# EAGLE design BORD 1 (EAGLE 9.6.2)
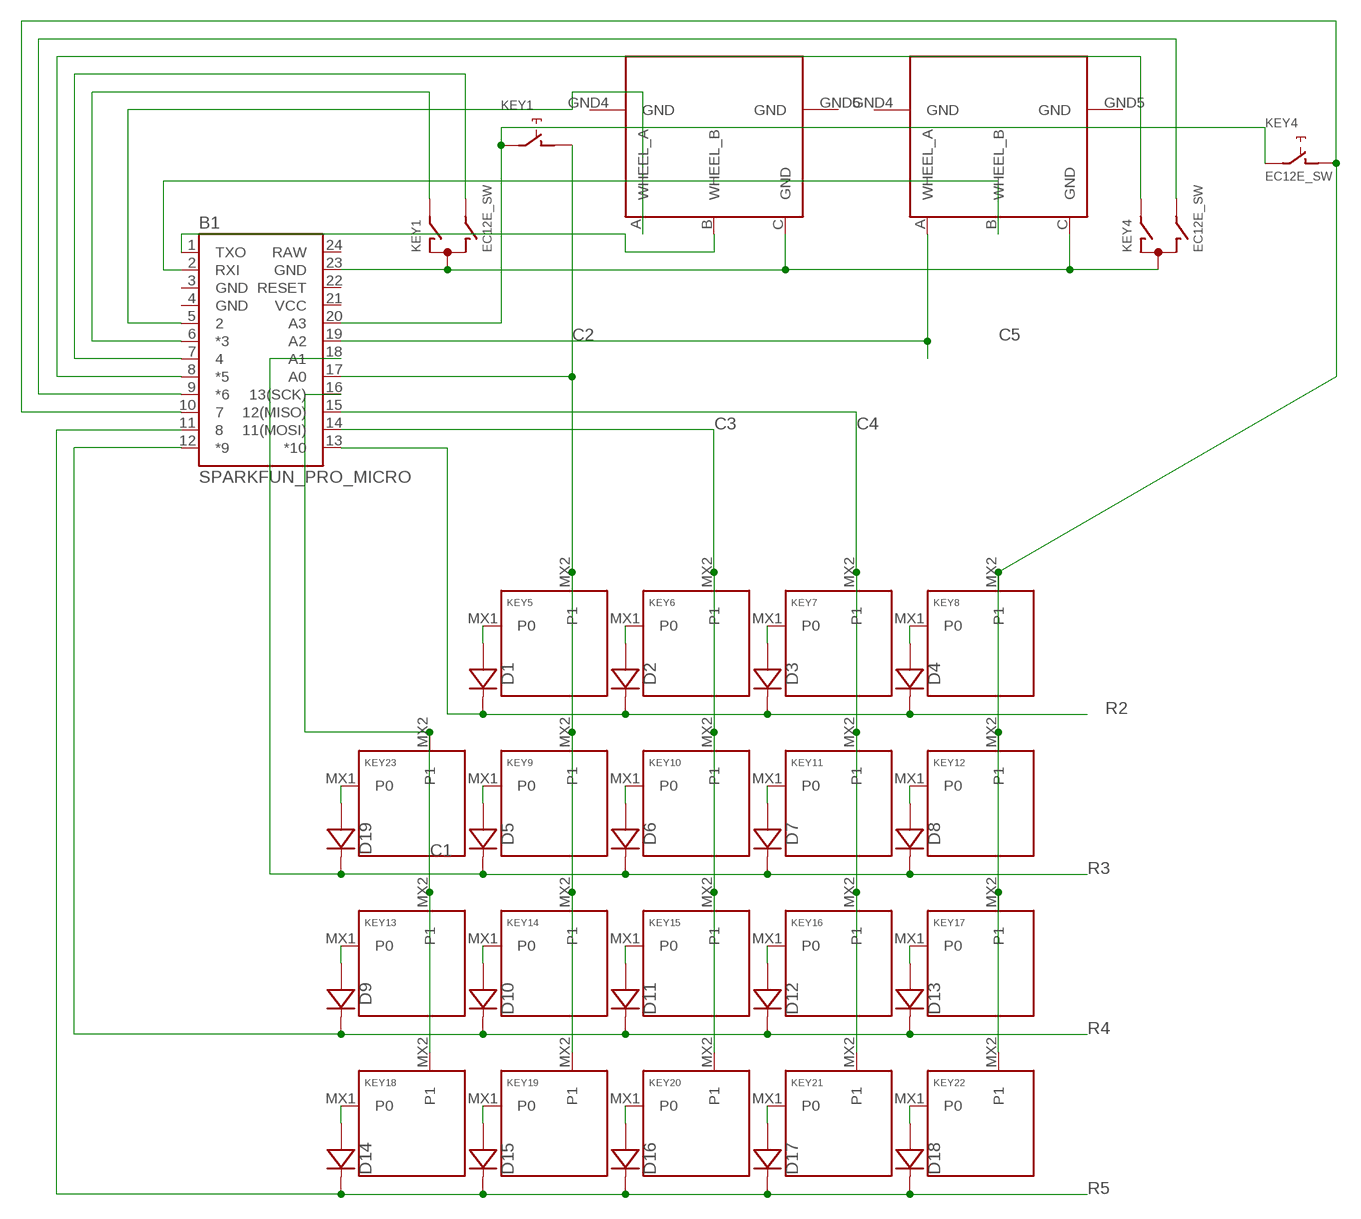
[diagram p0: schematic, sheet 1]

## Parts
B1  SPARKFUN_PRO_MICRO  [SPARKFUN_PRO_MICRO]
D1  DIODE-HAND  [DIODE_HAND]
D2  DIODE-HAND  [DIODE_HAND]
D3  DIODE-HAND  [DIODE_HAND]
D4  DIODE-HAND  [DIODE_HAND]
D5  DIODE-HAND  [DIODE_HAND]
D6  DIODE-HAND  [DIODE_HAND]
D7  DIODE-HAND  [DIODE_HAND]
D8  DIODE-HAND  [DIODE_HAND]
D9  DIODE-HAND  [DIODE_HAND]
D10  DIODE-HAND  [DIODE_HAND]
D11  DIODE-HAND  [DIODE_HAND]
D12  DIODE-HAND  [DIODE_HAND]
D13  DIODE-HAND  [DIODE_HAND]
D14  DIODE-HAND  [DIODE_HAND]
D15  DIODE-HAND  [DIODE_HAND]
D16  DIODE-HAND  [DIODE_HAND]
D17  DIODE-HAND  [DIODE_HAND]
D18  DIODE-HAND  [DIODE_HAND]
D19  DIODE-HAND  [DIODE_HAND]
KEY1  EC12E_SW  [ALPS_EC12E_SW]
KEY2  MOUSE_WHEEL_ENCODER  [MOUSE-PART]
KEY3  MOUSE_WHEEL_ENCODER  [MOUSE-PART]
KEY4  EC12E_SW  [ALPS_EC12E_SW]
KEY5  KEYSWITCH-PLAIN-MX-1U  [MX-1U]
KEY6  KEYSWITCH-PLAIN-MX-1U  [MX-1U]
KEY7  KEYSWITCH-PLAIN-MX-1U  [MX-1U]
KEY8  KEYSWITCH-PLAIN-MX-1U  [MX-1U]
KEY9  KEYSWITCH-PLAIN-MX-1U  [MX-1U]
KEY10  KEYSWITCH-PLAIN-MX-1U  [MX-1U]
KEY11  KEYSWITCH-PLAIN-MX-1U  [MX-1U]
KEY12  KEYSWITCH-PLAIN-MX-1U  [MX-1U]
KEY13  KEYSWITCH-PLAIN-MX-1U  [MX-1U]
KEY14  KEYSWITCH-PLAIN-MX-1U  [MX-1U]
KEY15  KEYSWITCH-PLAIN-MX-1U  [MX-1U]
KEY16  KEYSWITCH-PLAIN-MX-1U  [MX-1U]
KEY17  KEYSWITCH-PLAIN-MX-1U  [MX-1U]
KEY18  KEYSWITCH-PLAIN-MX-1U  [MX-1U]
KEY19  KEYSWITCH-PLAIN-MX-1U  [MX-1U]
KEY20  KEYSWITCH-PLAIN-MX-1U  [MX-1U]
KEY21  KEYSWITCH-PLAIN-MX-1U  [MX-1U]
KEY22  KEYSWITCH-PLAIN-MX-1U  [MX-1U]
KEY23  KEYSWITCH-PLAIN-MX-1U  [MX-1U]

## Nets
C1: B1.16(13(SCK)) KEY13.MX2(P1) KEY18.MX2(P1) KEY23.MX2(P1)
C2: B1.17(A0) KEY1.D KEY5.MX2(P1) KEY9.MX2(P1) KEY14.MX2(P1) KEY19.MX2(P1)
C3: B1.14(11(MOSI)) KEY6.MX2(P1) KEY10.MX2(P1) KEY15.MX2(P1) KEY20.MX2(P1)
C4: B1.15(12(MISO)) KEY7.MX2(P1) KEY11.MX2(P1) KEY16.MX2(P1) KEY21.MX2(P1)
C5: B1.10 KEY4.D KEY8.MX2(P1) KEY12.MX2(P1) KEY17.MX2(P1) KEY22.MX2(P1)
N$1: D1.A1(A) D1.A2(A) D1.A3(A) KEY5.MX1(P0)
N$2: D2.A1(A) D2.A2(A) D2.A3(A) KEY6.MX1(P0)
N$3: D3.A1(A) D3.A2(A) D3.A3(A) KEY7.MX1(P0)
N$4: D4.A1(A) D4.A2(A) D4.A3(A) KEY8.MX1(P0)
N$5: D5.A1(A) D5.A2(A) D5.A3(A) KEY9.MX1(P0)
N$6: D6.A1(A) D6.A2(A) D6.A3(A) KEY10.MX1(P0)
N$7: D7.A1(A) D7.A2(A) D7.A3(A) KEY11.MX1(P0)
N$8: D8.A1(A) D8.A2(A) D8.A3(A) KEY12.MX1(P0)
N$9: D9.A1(A) D9.A2(A) D9.A3(A) KEY13.MX1(P0)
N$10: D10.A1(A) D10.A2(A) D10.A3(A) KEY14.MX1(P0)
N$11: D11.A1(A) D11.A2(A) D11.A3(A) KEY15.MX1(P0)
N$12: D12.A1(A) D12.A2(A) D12.A3(A) KEY16.MX1(P0)
N$13: D13.A1(A) D13.A2(A) D13.A3(A) KEY17.MX1(P0)
N$14: D14.A1(A) D14.A2(A) D14.A3(A) KEY18.MX1(P0)
N$15: D15.A1(A) D15.A2(A) D15.A3(A) KEY19.MX1(P0)
N$16: D16.A1(A) D16.A2(A) D16.A3(A) KEY20.MX1(P0)
N$17: D17.A1(A) D17.A2(A) D17.A3(A) KEY21.MX1(P0)
N$18: D18.A1(A) D18.A2(A) D18.A3(A) KEY22.MX1(P0)
N$19: B1.23(GND) KEY1.C KEY2.C(GND) KEY3.C(GND) KEY4.C
N$20: B1.20(A3) KEY1.E KEY4.E
N$21: B1.6(*3) KEY1.A
N$22: B1.7 KEY1.B
N$24: B1.8(*5) KEY4.A
N$25: B1.19(A2) KEY3.A(WHEEL_A)
N$26: B1.5 KEY2.A(WHEEL_A)
N$27: B1.1(TXO) KEY2.B(WHEEL_B)
N$28: B1.9(*6) KEY4.B
N$29: D19.A1(A) D19.A2(A) D19.A3(A) KEY23.MX1(P0)
N$30: B1.2(RXI) KEY3.B(WHEEL_B)
R2: B1.13(*10) D1.C1(C) D1.C2(C) D1.C3(C) D2.C1(C) D2.C2(C) D2.C3(C) D3.C1(C) D3.C2(C) D3.C3(C) D4.C1(C) D4.C2(C) D4.C3(C)
R3: B1.18(A1) D5.C1(C) D5.C2(C) D5.C3(C) D6.C1(C) D6.C2(C) D6.C3(C) D7.C1(C) D7.C2(C) D7.C3(C) D8.C1(C) D8.C2(C) D8.C3(C) D19.C1(C) D19.C2(C) D19.C3(C)
R4: B1.12(*9) D9.C1(C) D9.C2(C) D9.C3(C) D10.C1(C) D10.C2(C) D10.C3(C) D11.C1(C) D11.C2(C) D11.C3(C) D12.C1(C) D12.C2(C) D12.C3(C) D13.C1(C) D13.C2(C) D13.C3(C)
R5: B1.11 D14.C1(C) D14.C2(C) D14.C3(C) D15.C1(C) D15.C2(C) D15.C3(C) D16.C1(C) D16.C2(C) D16.C3(C) D17.C1(C) D17.C2(C) D17.C3(C) D18.C1(C) D18.C2(C) D18.C3(C)
Unconnected: B1.22(RESET) KEY1.GND1(G) KEY1.GND2(G) KEY2.GND4(GND) KEY2.GND5(GND) KEY3.GND4(GND) KEY3.GND5(GND) KEY4.GND1(G) KEY4.GND2(G)

## Power pins joined to a net without a drawn wire
GND: B1.3(GND) B1.4(GND)
RAW: B1.24(RAW)
VCC: B1.21(VCC)

## Library data of the parts
B1 = SparkFun-Boards:SPARKFUN_PRO_MICRO: SparkFun Pro Micro Atmega32U4 compatible footprint. SparkFun Products: 3.3V/8MHz <https://www.sparkfun.com/products/12587> 5V/16MHz <https://www.sparkfun.com/products/12640>
D1-D19 = Components:DIODE: Standard 1N4148 diode
KEY1 KEY4 = switch-alps:EC12E_SW: ALPS rotary Encoder EC12E series with switch; MPN: EC12E2424407; OC_FARNELL: 1520813; OC_NEWARK: 74M1068
KEY2 KEY3 = Mouse:MOUSE_WHEEL_ENCODER
KEY5-KEY23 = Keyboard:KEYSWITCH-PLAIN

## Net classes
0 default: width 0.305 mm, drill 0.508 mm, clearance 0.254 mm

## Board
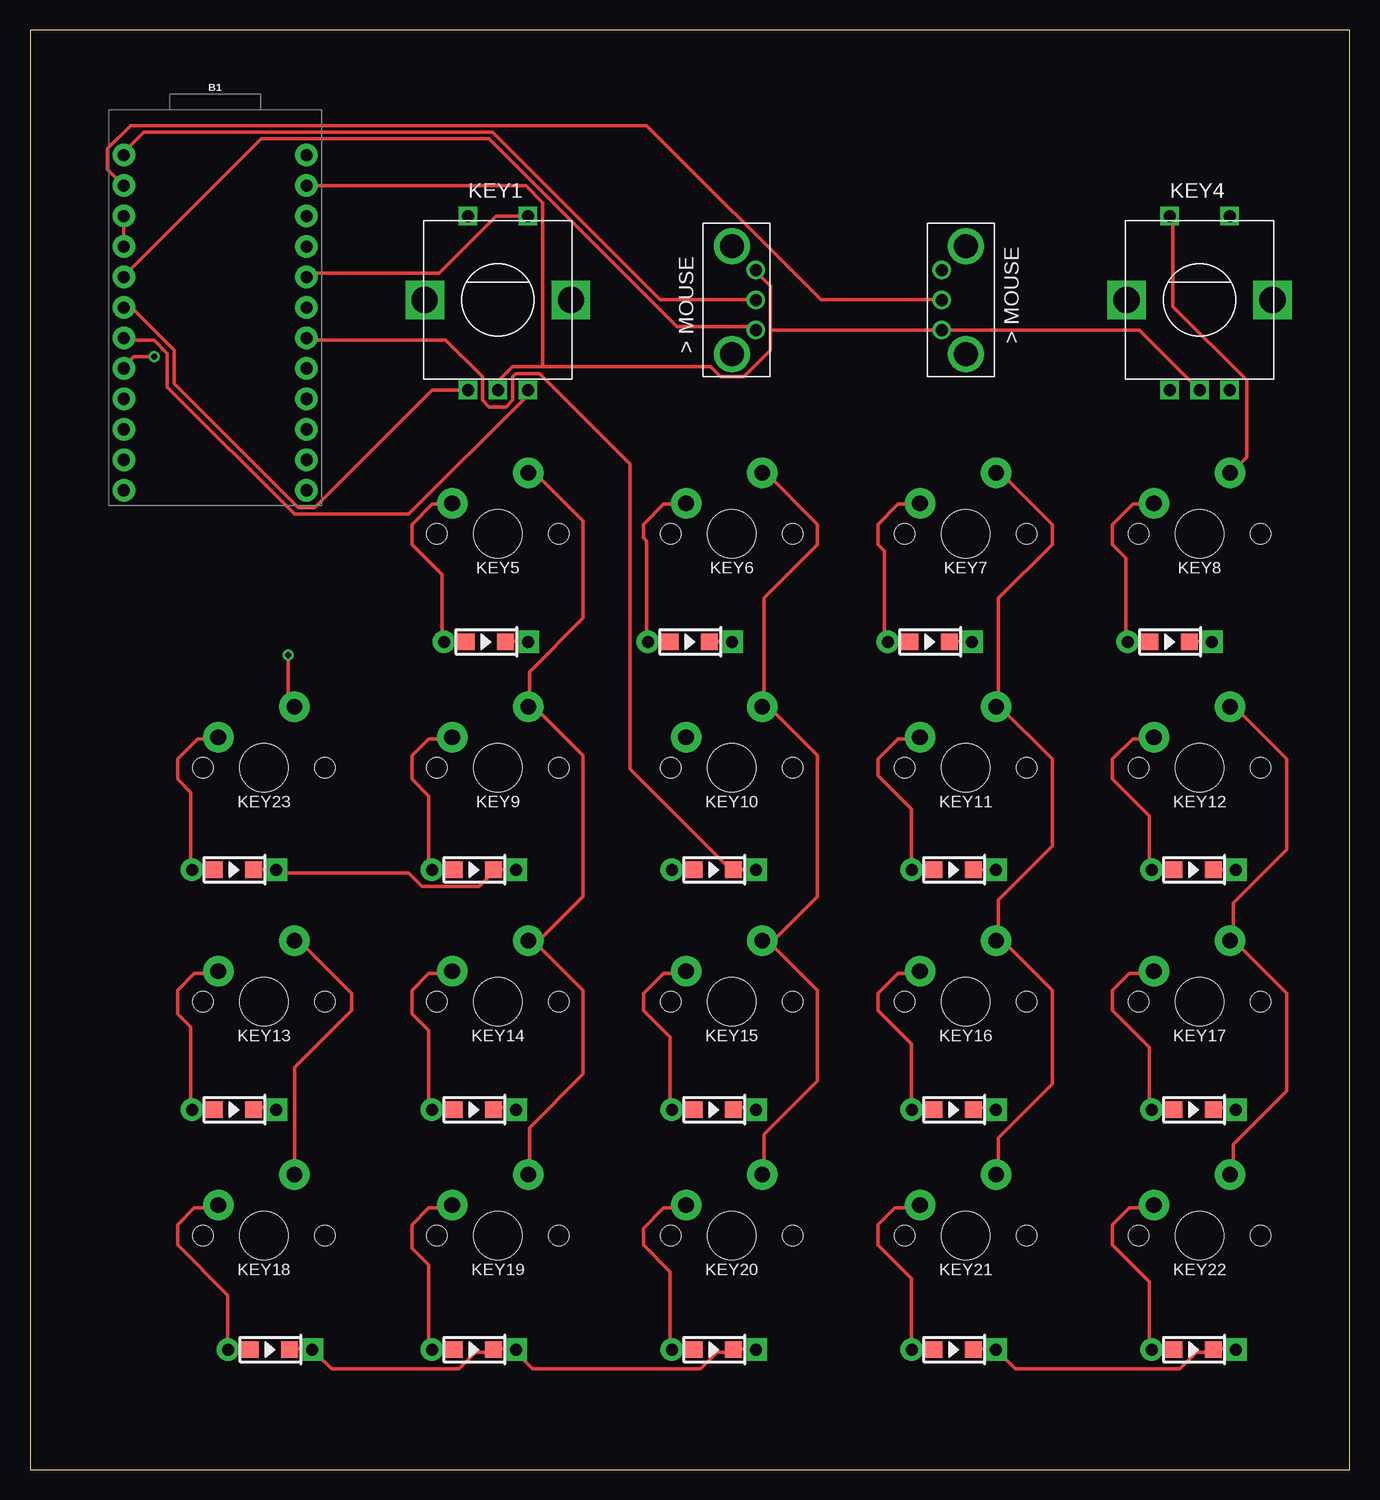
[diagram p1: board, top side]
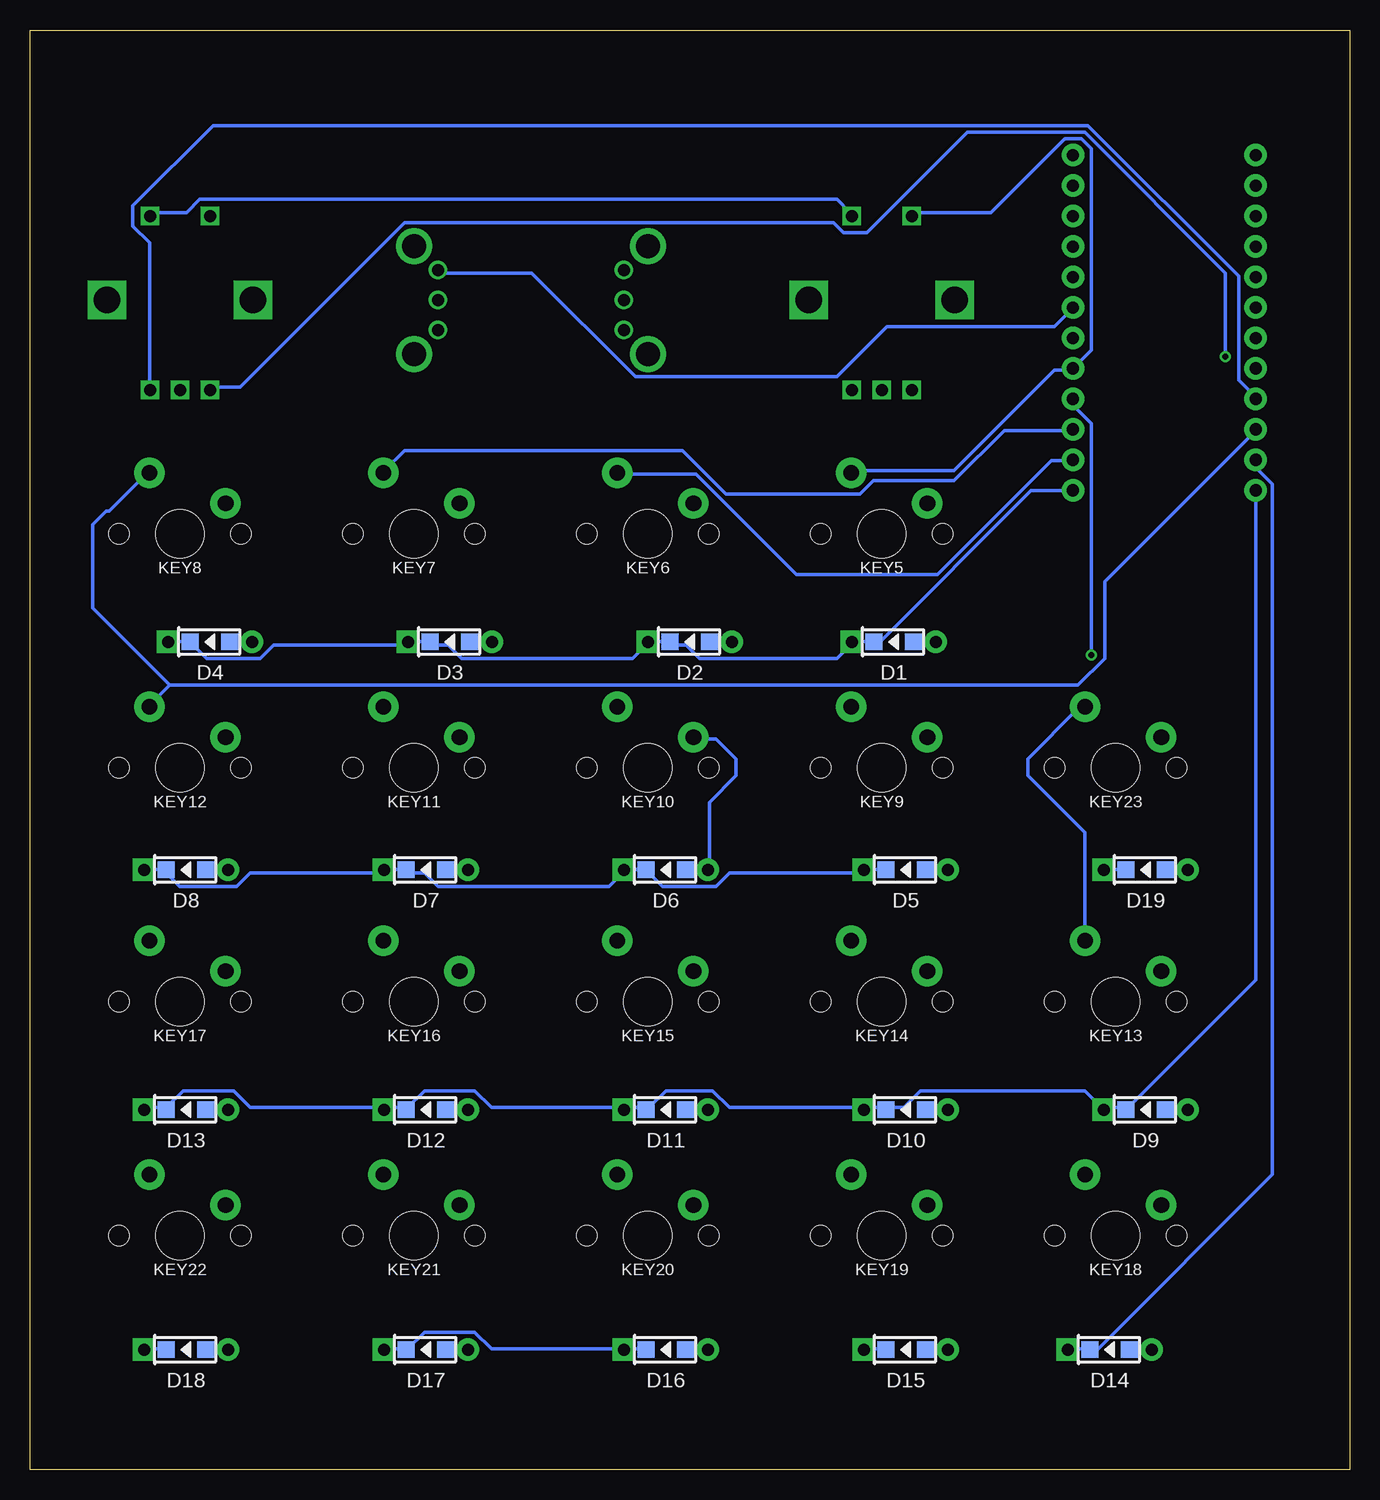
[diagram p2: board, bottom side, seen from below]

Size 110 x 120 mm. Coordinates in mm from the lower left corner, seen from the top.
Outline: 0,0 110,0 110,120 0,120 0,0
Copper layers (1*16): Top 0.035mm / dielectric 1.5mm / Bottom 0.035mm
Design rules "default": minimum track width 6mil, minimum drill 0.35mm, track to track 6mil, track to pad 6mil, pad to pad 6mil, via to via 6mil, smd to smd 6mil, copper to edge 40mil, drill to drill 6mil, minimum pad ring 10mil, minimum via ring 8mil, stop-mask expansion 4mil, vias tented up to drill 0mil, thermal gap 10mil

### Footprints (pad centres in the part's own frame; a part is rotated, then mirrored left to right if it is on the bottom)
SPARKFUN_PRO_MICRO = drill 1.016 pad 1.88: 1 -7.62,12.7; 2 -7.62,10.16; 3 -7.62,7.62; 4 -7.62,5.08; 5 -7.62,2.54; 6 -7.62,0; 7 -7.62,-2.54; 8 -7.62,-5.08; 9 -7.62,-7.62; 10 -7.62,-10.16; 11 -7.62,-12.7; 12 -7.62,-15.24; 13 7.62,-15.24; 14 7.62,-12.7; 15 7.62,-10.16; 16 7.62,-7.62; 17 7.62,-5.08; 18 7.62,-2.54; 19 7.62,0; 20 7.62,2.54; 21 7.62,5.08; 22 7.62,7.62; 23 7.62,10.16; 24 7.62,12.7
DIODE_HAND = smd 1.397 x 1.397: A1 -1.651,0; C1 1.651,0 | drill 1 pad 1.9: A2 -3.5,0 | smd 1.397 x 1.397 bottom: A3 -1.651,0; C3 1.651,0 | drill 1 pad 1.9 square: C2 3.5,0
ALPS_EC12E_SW = drill 1 square: A -2.5,-7.5; B 2.5,-7.5; C 0,-7.5; D -2.5,7; E 2.5,7 | drill 2.2 square: GND1 -6.1,0; GND2 6.1,0
MOUSE-PART = drill 1: A -2.5,-2; B 0,-2; C 2.5,-2 | drill 2: GND4 -4.5,0; GND5 4.5,0
MX-1U = drill 1.3 pad 2.54: MX1 -3.81,2.54; MX2 2.54,5.08 | hole 4: 0,0 | hole 1.7: -5.08,0; 5.08,0

### Placement (x,y rotation side)
B1  15.44,96.86 0 top
D1  38,69 180 bottom
D2  55,69 180 bottom
D3  75,69 180 bottom
D4  95,69 180 bottom
D5  37,50 180 bottom
D6  57,50 180 bottom
D7  77,50 180 bottom
D8  97,50 180 bottom
D9  17,30 180 bottom
D10  37,30 180 bottom
D11  57,30 180 bottom
D12  77,30 180 bottom
D13  97,30 180 bottom
D14  20,10 180 bottom
D15  37,10 180 bottom
D16  57,10 180 bottom
D17  77,10 180 bottom
D18  97,10 180 bottom
D19  17,50 180 bottom
KEY1  39,97.5 0 top
KEY2  58.5,97.5 90 top
KEY3  78,97.5 270 top
KEY4  97.5,97.5 0 top
KEY5  39,78 0 top
KEY6  58.5,78 0 top
KEY7  78,78 0 top
KEY8  97.5,78 0 top
KEY9  39,58.5 0 top
KEY10  58.5,58.5 0 top
KEY11  78,58.5 0 top
KEY12  97.5,58.5 0 top
KEY13  19.5,39 0 top
KEY14  39,39 0 top
KEY15  58.5,39 0 top
KEY16  78,39 0 top
KEY17  97.5,39 0 top
KEY18  19.5,19.5 0 top
KEY19  39,19.5 0 top
KEY20  58.5,19.5 0 top
KEY21  78,19.5 0 top
KEY22  97.5,19.5 0 top
KEY23  19.5,58.5 0 top

### Tracks (layer width: path | path; a pad name or v marks a point on that pad's centre or on a via)
C1  (via drill 0.51)
  Top 0.305: KEY18.MX2 22.07,24.59 22.07,33.53 26.82,38.28 26.82,39.67 22.63,43.87 22.07,43.87 KEY13.MX2 | v21.51,67.89 21.51,63.98 21.79,63.7 KEY23.MX2
  Bottom 0.305: v21.51,67.89 21.51,87.17 22.91,88.57 22.91,89.13 B1.16 | KEY13.MX2 22.07,44.15 22.07,53.09 26.82,57.84 26.82,59.23 22.63,63.42 22.07,63.42 KEY23.MX2
C2
  Top 0.305: 42.19,43.87 46.1,39.95 46.1,32.97 41.63,28.5 41.63,24.59 KEY19.MX2 | 42.19,43.87 41.63,43.87 KEY14.MX2 42.19,43.87 | 42.19,43.87 46.1,47.78 46.1,59.51 42.19,63.42 41.63,63.42 KEY9.MX2 41.63,63.7 41.63,66.5 46.1,70.97 46.1,79.07 42.19,82.98 41.63,82.98 KEY5.MX2
  Bottom 0.305: KEY1.D 36.32,104.78 29.9,104.78 23.75,110.92 22.35,110.92 21.51,110.08 21.51,93.32 22.91,91.92 B1.17 23.19,91.64 24.59,91.64 32.97,83.26 41.35,83.26 KEY5.MX2
C3
  Top 0.305: 61.75,43.87 65.66,39.95 65.66,32.41 61.19,27.94 61.19,24.59 KEY20.MX2 | 61.75,43.87 61.19,43.87 KEY15.MX2 61.75,43.87 | 61.75,43.87 65.66,47.78 65.66,59.51 61.75,63.42 61.19,63.42 KEY10.MX2 61.19,63.7 61.19,72.64 65.66,77.11 65.66,78.79 61.19,83.26 KEY6.MX2
  Bottom 0.305: B1.14 23.19,84.1 24.87,84.1 34.37,74.6 46.1,74.6 54.48,82.98 60.91,82.98 KEY6.MX2
C4
  Top 0.305: KEY21.MX2 80.75,24.59 80.75,27.66 85.22,32.13 85.22,39.95 81.31,43.87 80.75,43.87 KEY16.MX2 80.75,44.15 80.75,47.5 85.22,51.97 85.22,59.23 80.75,63.7 | 80.75,63.7 80.75,72.64 85.22,77.11 85.22,78.79 80.75,83.26 KEY7.MX2 | 80.75,63.7 KEY11.MX2
  Bottom 0.305: B1.15 23.19,86.61 28.78,86.61 32.97,82.42 39.67,82.42 40.79,81.31 51.97,81.31 55.6,84.94 78.79,84.94 80.47,83.26 KEY7.MX2
C5
  Top 0.305: KEY4.D 95.28,104.5 95.28,96.95 101.42,90.81 101.42,84.38 100.31,83.26 KEY8.MX2 | 100.31,44.15 104.78,39.67 104.78,31.57 100.31,27.1 100.31,24.59 KEY22.MX2 | 100.31,44.15 100.31,47.22 104.78,51.69 104.78,59.23 100.31,63.7 KEY12.MX2 | 100.31,44.15 KEY17.MX2
  Bottom 0.305: 98.35,65.38 22.63,65.38 20.4,67.61 20.4,74.04 7.82,86.61 B1.10 | 98.35,65.38 100.03,63.7 KEY12.MX2 | 98.35,65.38 104.78,71.81 104.78,78.79 103.66,79.91 103.38,79.91 100.31,82.98 KEY8.MX2
GND
  Top 0.305: B1.4 7.82,101.98 7.82,104.22 B1.3
N$1
  Top 0.305: D1.A1 36.32,69.01 34.65,69.01 D1.A2 34.37,69.01 34.37,74.6 31.85,77.11 31.85,78.79 33.53,80.47 34.92,80.47 KEY5.MX1
  Bottom 0.305: D1.A1 36.32,69.01 34.65,69.01 D1.A2
N$2
  Top 0.305: D2.A1 53.09,69.01 51.69,69.01 D2.A2 51.41,69.01 51.41,77.39 51.13,77.67 51.13,78.79 52.81,80.47 54.48,80.47 KEY6.MX1
  Bottom 0.305: D2.A1 53.09,69.01 51.69,69.01 D2.A2
N$3
  Top 0.305: D3.A1 73.2,69.01 71.53,69.01 D3.A2 71.25,69.01 71.25,76.56 70.69,77.11 70.69,78.79 72.36,80.47 74.04,80.47 KEY7.MX1
  Bottom 0.305: D3.A1 73.2,69.01 71.53,69.01 D3.A2
N$4
  Top 0.305: D4.A1 93.32,69.01 91.64,69.01 D4.A2 91.36,69.01 91.36,76 90.25,77.11 90.25,78.79 91.92,80.47 93.6,80.47 KEY8.MX1
  Bottom 0.305: D4.A1 93.32,69.01 91.64,69.01 D4.A2
N$5
  Top 0.305: D5.A1 35.2,50.01 33.53,50.01 D5.A2 33.25,50.01 33.25,56.16 31.85,57.56 31.85,59.51 33.25,60.91 34.92,60.91 KEY9.MX1
  Bottom 0.305: D5.A1 35.2,50.01 33.53,50.01 D5.A2
N$6
  Top 0.305: D6.A1 55.32,50.01 53.65,50.01 D6.A2
  Bottom 0.305: D6.A1 55.32,50.01 53.65,50.01 D6.A2 53.37,50.01 53.37,55.6 51.13,57.84 51.13,59.23 52.81,60.91 54.48,60.91 KEY10.MX1
N$7
  Top 0.305: D7.A1 75.16,50.01 73.76,50.01 D7.A2 73.48,50.01 73.48,55.04 70.69,57.84 70.69,59.23 72.36,60.91 74.04,60.91 KEY11.MX1
  Bottom 0.305: D7.A1 75.16,50.01 73.76,50.01 D7.A2
N$8
  Top 0.305: D8.A1 95.28,50.01 93.6,50.01 D8.A2 93.32,50.01 93.32,54.48 90.25,57.56 90.25,59.23 91.92,60.91 93.6,60.91 KEY12.MX1
  Bottom 0.305: D8.A1 95.28,50.01 93.6,50.01 D8.A2
N$9
  Top 0.305: D9.A1 15.09,30.18 13.69,30.18 D9.A2 13.41,30.18 13.41,36.88 12.29,38 12.29,39.95 13.69,41.35 15.65,41.35 KEY13.MX1
  Bottom 0.305: D9.A1 15.09,30.18 13.69,30.18 D9.A2
N$10
  Top 0.305: D10.A1 35.2,30.18 33.53,30.18 D10.A2 33.25,30.18 33.25,36.6 31.85,38 31.85,39.95 33.25,41.35 34.92,41.35 KEY14.MX1
  Bottom 0.305: D10.A1 35.2,30.18 33.53,30.18 D10.A2
N$11
  Top 0.305: D11.A1 55.32,30.18 53.65,30.18 D11.A2 53.37,30.18 53.37,36.04 51.13,38.28 51.13,39.67 52.81,41.35 54.48,41.35 KEY15.MX1
  Bottom 0.305: D11.A1 55.32,30.18 53.65,30.18 D11.A2
N$12
  Top 0.305: D12.A1 75.16,30.18 73.76,30.18 D12.A2 73.48,30.18 73.48,35.48 70.69,38.28 70.69,39.67 72.36,41.35 74.04,41.35 KEY16.MX1
  Bottom 0.305: D12.A1 75.16,30.18 73.76,30.18 D12.A2
N$13
  Top 0.305: D13.A1 95.28,30.18 93.6,30.18 D13.A2 93.32,30.18 93.32,35.2 90.25,38.28 90.25,39.95 91.64,41.35 93.6,41.35 KEY17.MX1
  Bottom 0.305: D13.A1 95.28,30.18 93.6,30.18 D13.A2
N$14
  Top 0.305: D14.A1 18.16,10.06 16.76,10.06 D14.A2 16.48,10.06 16.48,14.53 12.29,18.72 12.29,20.4 13.69,21.79 15.65,21.79 KEY18.MX1
  Bottom 0.305: D14.A1 18.16,10.06 16.76,10.06 D14.A2
N$15
  Top 0.305: D15.A1 35.2,10.06 33.53,10.06 D15.A2 33.25,10.06 33.25,17.04 31.85,18.44 31.85,20.4 33.25,21.79 34.92,21.79 KEY19.MX1
  Bottom 0.305: D15.A1 35.2,10.06 33.53,10.06 D15.A2
N$16
  Top 0.305: D16.A1 55.32,10.06 53.65,10.06 D16.A2 53.37,10.06 53.37,16.48 51.13,18.72 51.13,20.12 52.81,21.79 54.48,21.79 KEY20.MX1
  Bottom 0.305: D16.A1 55.32,10.06 53.65,10.06 D16.A2
N$17
  Top 0.305: D17.A1 75.16,10.06 73.76,10.06 D17.A2 73.48,10.06 73.48,15.93 70.69,18.72 70.69,20.4 72.08,21.79 74.04,21.79 KEY21.MX1
  Bottom 0.305: D17.A1 75.16,10.06 73.76,10.06 D17.A2
N$18
  Top 0.305: D18.A1 95.28,10.06 93.6,10.06 D18.A2 93.32,10.06 93.32,15.65 90.25,18.72 90.25,20.4 91.64,21.79 93.6,21.79 KEY22.MX1
  Bottom 0.305: D18.A1 95.28,10.06 93.6,10.06 D18.A2
N$19
  Top 0.305: 42.75,91.92 56.72,91.92 57.56,91.08 59.51,91.08 61.75,93.32 61.75,95 | 42.75,91.92 40.23,91.92 39.12,90.81 39.12,90.25 KEY1.C | 61.75,95 61.75,98.63 60.63,99.75 KEY2.C | 61.75,95 KEY3.C 76.28,95 92.48,95 97.23,90.25 KEY4.C | 42.75,91.92 42.75,105.61 41.35,107.01 23.19,107.01 B1.23
N$20
  Top 0.305: KEY1.E 41.35,104.5 38.84,104.5 34.09,99.75 23.47,99.75 23.19,99.47 B1.20
  Bottom 0.305: KEY4.E 99.75,104.78 96.95,104.78 95.83,105.89 42.75,105.89 41.63,104.78 KEY1.E
N$21
  Top 0.305: KEY1.A 36.32,89.97 33.53,89.97 23.75,80.19 22.35,80.19 12.01,90.53 12.01,93.32 8.66,96.67 7.82,96.67 B1.6
N$22
  Top 0.305: KEY1.B 41.35,89.97 41.35,89.41 31.57,79.63 22.07,79.63 11.46,90.25 11.46,93.04 10.34,94.16 7.82,94.16 B1.7
N$24  (via drill 0.51)
  Top 0.305: v10.34,92.76 8.66,92.76 7.82,91.92 B1.8
  Bottom 0.305: v10.34,92.76 10.34,99.75 22.07,111.48 31.85,111.48 40.23,103.1 42.19,103.1 43.03,103.94 78.79,103.94 92.48,90.25 95,90.25 KEY4.A
N$25
  Bottom 0.305: KEY3.A 76,99.75 68.17,99.75 59.51,91.08 42.75,91.08 38.56,95.28 24.59,95.28 23.19,96.67 B1.19
N$26
  Top 0.305: KEY2.A 60.35,95.28 53.92,95.28 38.28,110.92 19.28,110.92 7.82,99.47 B1.5
N$27
  Top 0.305: KEY2.B 60.35,97.51 52.53,97.51 38.56,111.48 9.5,111.48 7.82,109.8 B1.1
N$28
  Bottom 0.305: KEY4.B 100.03,90.25 100.03,102.26 101.42,103.66 101.42,105.33 94.72,112.04 21.79,112.04 9.22,99.47 9.22,90.81 7.82,89.41 B1.9
N$29
  Top 0.305: D19.A1 15.09,50.01 13.69,50.01 D19.A2 13.41,50.01 13.41,56.44 12.29,57.56 12.29,59.23 13.97,60.91 15.65,60.91 KEY23.MX1
  Bottom 0.305: D19.A1 15.09,50.01 13.69,50.01 D19.A2
N$30
  Top 0.305: KEY3.B 65.94,97.51 51.41,112.04 8.38,112.04 6.43,110.08 6.43,108.41 7.54,107.29 B1.2
R2
  Top 0.305: D3.C1 76.83,69.01 78.23,69.01 D3.C2 | D4.C1 96.67,69.01 98.35,69.01 D4.C2 | D2.C1 56.72,69.01 58.4,69.01 D2.C2 | D1.C1 39.67,69.01 41.35,69.01 D1.C2
  Bottom 0.305: D4.C2 98.35,69.01 96.67,69.01 D4.C1 96.39,68.73 95.28,67.61 90.81,67.61 89.69,68.73 78.51,68.73 D3.C2 78.23,69.01 76.83,69.01 D3.C1 76.56,68.73 75.16,68.73 74.04,67.61 59.79,67.61 58.67,68.73 D2.C2 58.4,69.01 56.72,69.01 D2.C1 56.44,68.73 55.32,68.73 54.2,67.61 42.75,67.61 41.63,68.73 D1.C2 41.35,69.01 39.67,69.01 D1.C1 39.4,68.73 26.54,81.58 23.19,81.58 B1.13
R3
  Top 0.305: D7.C1 78.79,50.01 80.47,50.01 D7.C2 | D8.C1 98.91,50.01 100.31,50.01 D8.C2 | D19.C3 18.72,50.01 20.4,50.01 D19.C2 20.68,49.73 31.57,49.73 32.69,48.62 37.44,48.62 38.56,49.73 D5.C1 38.84,50.01 40.23,50.01 D5.C2 | D6.C2 60.35,50.01 58.67,50.01 D6.C1 58.4,50.01 50.01,58.4 50.01,83.82 42.47,91.36 40.51,91.36 40.23,91.08 40.23,89.13 39.67,88.57 38.28,88.57 37.72,89.13 37.72,91.08 34.65,94.16 23.19,94.16 B1.18
  Bottom 0.305: D8.C2 100.31,50.01 98.91,50.01 D8.C1 98.63,49.73 97.51,48.62 92.76,48.62 91.64,49.73 80.75,49.73 D7.C2 80.47,50.01 78.79,50.01 D7.C1 78.51,49.73 77.11,49.73 76,48.62 61.75,48.62 60.63,49.73 D6.C2 60.35,50.01 58.67,50.01 D6.C1 58.4,49.73 57.28,48.62 52.81,48.62 51.69,49.73 40.51,49.73 D5.C2 40.23,50.01 38.84,50.01 D5.C1 | D19.C3 18.72,50.01 20.4,50.01 D19.C2
R4
  Top 0.305: D10.C1 38.84,30.18 40.23,30.18 D10.C2 | D11.C1 58.67,30.18 60.35,30.18 D11.C2 | D12.C1 78.79,30.18 80.47,30.18 D12.C2 | D13.C1 98.91,30.18 100.31,30.18 D13.C2 | D9.C1 18.72,30.18 20.4,30.18 D9.C2
  Bottom 0.305: D13.C2 100.31,30.18 98.91,30.18 D13.C1 98.63,30.18 97.23,31.57 93.04,31.57 91.64,30.18 80.75,30.18 D12.C2 80.47,30.18 78.79,30.18 D12.C1 78.51,30.18 77.11,31.57 72.92,31.57 71.53,30.18 60.63,30.18 D11.C2 60.35,30.18 58.67,30.18 D11.C1 58.4,30.18 57,31.57 53.09,31.57 51.69,30.18 40.51,30.18 D10.C2 40.23,30.18 38.84,30.18 D10.C1 38.56,30.18 37.16,30.18 35.76,31.57 22.07,31.57 20.68,30.18 D9.C2 20.4,30.18 18.72,30.18 D9.C1 18.44,30.18 7.82,40.79 7.82,81.58 B1.12
R5
  Top 0.305: D18.C2 100.31,10.06 98.91,10.06 D18.C1 98.63,9.78 97.23,9.78 95.83,8.38 82.14,8.38 80.75,9.78 D17.C2 80.47,10.06 78.79,10.06 D17.C1 | D16.C2 60.35,10.06 58.67,10.06 D16.C1 58.4,9.78 57.28,9.78 55.88,8.38 41.91,8.38 40.51,9.78 D15.C2 40.23,10.06 38.84,10.06 D15.C1 38.56,9.78 37.16,9.78 35.76,8.38 25.15,8.38 23.75,9.78 D14.C2 23.47,10.06 21.79,10.06 D14.C1
  Bottom 0.305: D18.C1 98.91,10.06 100.31,10.06 D18.C2 | D16.C1 58.67,10.06 60.35,10.06 D16.C2 60.63,10.06 71.53,10.06 72.92,11.46 77.11,11.46 78.51,10.06 D17.C1 78.79,10.06 80.47,10.06 D17.C2 | D15.C1 38.84,10.06 40.23,10.06 D15.C2 | D14.C2 23.47,10.06 21.79,10.06 D14.C1 21.51,10.06 20.95,10.06 6.43,24.59 6.43,82.14 7.54,83.26 7.54,84.1 B1.11